# EAGLE design circuitdraft (EAGLE 9.5.2)
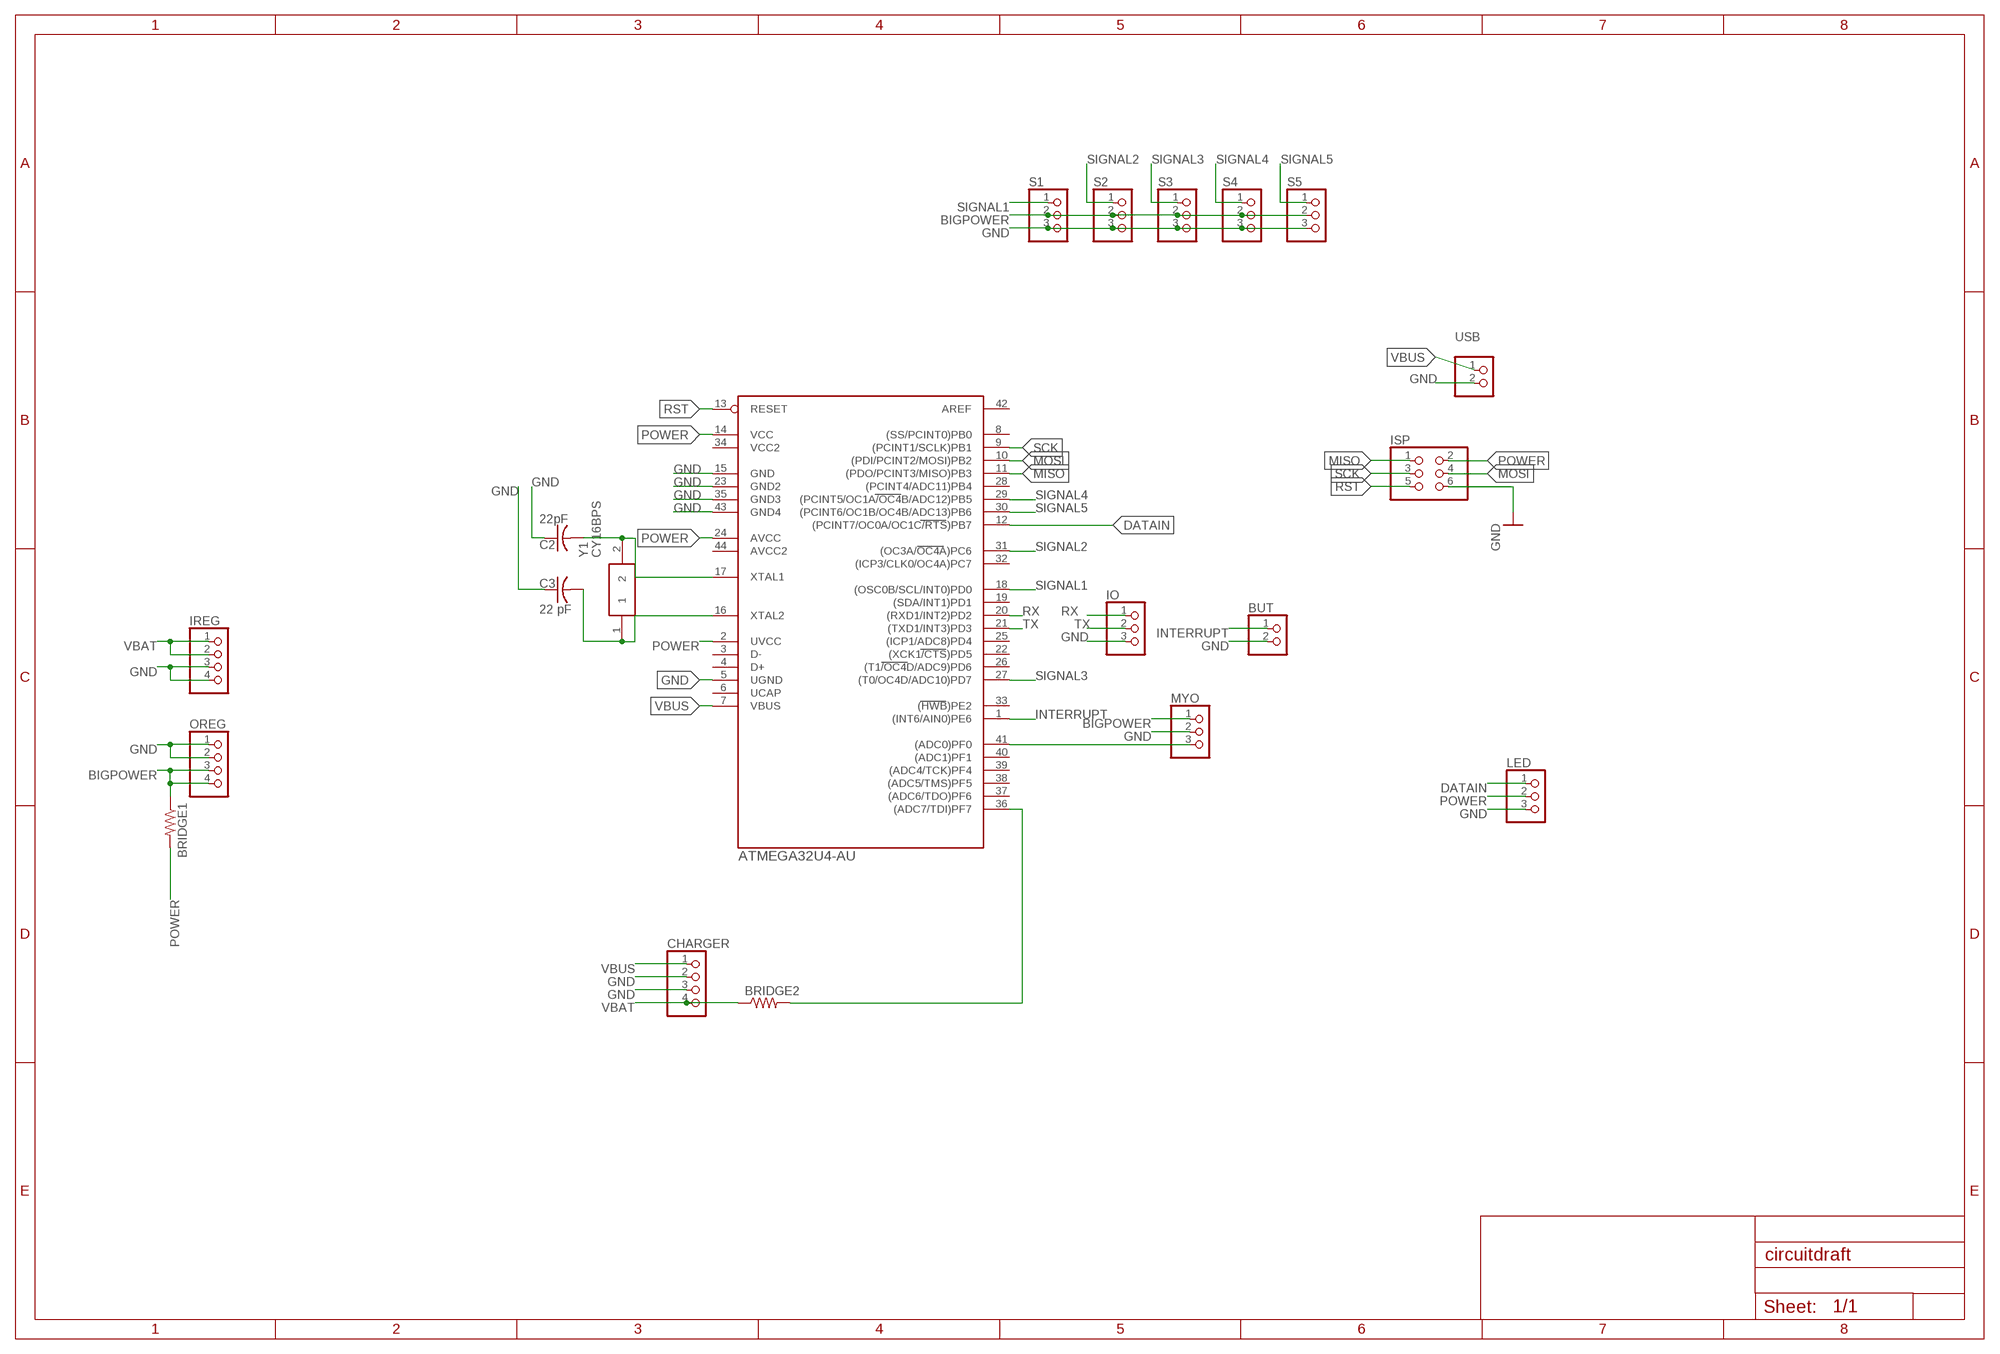
[diagram p0: schematic, sheet 1]

## Parts
BRIDGE1  R-US_M0805  [M0805]
BRIDGE2  R-US_M0805  [M0805]
BUT  PINHD-1X2  [1X02]
C2  22pF  C-US025-024X044  [C025-024X044]
C3  22 pF  C-US025-024X044  [C025-024X044]
CHARGER  PINHD-1X4  [1X04]
IO  PINHD-1X3  [1X03]
IREG  PINHD-1X4  [1X04]
ISP  PINHD-2X3  [2X03]
LED  PINHD-1X3  [1X03]
MYO  PINHD-1X3  [1X03]
OREG  PINHD-1X4  [1X04]
S1  PINHD-1X3  [1X03]
S2  PINHD-1X3  [1X03]
S3  PINHD-1X3  [1X03]
S4  PINHD-1X3  [1X03]
S5  PINHD-1X3  [1X03]
U$1  ATMEGA32U4-AU  [TQFP44]
USB  PINHD-1X2  [1X02]
Y1  CY16BPS  [CY16BPS]

## Nets
BIGPOWER [power]: BRIDGE1.1 MYO.1 OREG.3 OREG.4 S1.2 S2.2 S3.2 S4.2 S5.2
DATAIN: LED.1 U$1.12((PCINT7/OC0A/OC1C/RTS)PB7)
GND: BUT.2 C2.1 C3.1 CHARGER.2 CHARGER.3 IO.3 IREG.3 IREG.4 ISP.6 LED.3 MYO.2 OREG.1 OREG.2 S1.3 S2.3 S3.3 S4.3 S5.3 U$1.5(UGND) U$1.15(GND) U$1.23(GND2) U$1.35(GND3) U$1.43(GND4) USB.2
INTERRUPT: BUT.1 U$1.1((INT6/AIN0)PE6)
MISO: ISP.1 U$1.11((PDO/PCINT3/MISO)PB3)
MOSI: ISP.4 U$1.10((PDI/PCINT2/MOSI)PB2)
N$1: MYO.3 U$1.41((ADC0)PF0)
N$5: C2.2 U$1.17(XTAL1) Y1.2
N$6: C3.2 U$1.16(XTAL2) Y1.1
N$9: BRIDGE2.2 U$1.36((ADC7/TDI)PF7)
POWER: BRIDGE1.2 ISP.2 LED.2 U$1.2(UVCC) U$1.14(VCC) U$1.24(AVCC)
RST: ISP.5 U$1.13(RESET)
RX: IO.1 U$1.20((RXD1/INT2)PD2)
SCK: ISP.3 U$1.9((PCINT1/SCLK)PB1)
SIGNAL1: S1.1 U$1.18((OSC0B/SCL/INT0)PD0)
SIGNAL2: S2.1 U$1.31((OC3A/OC4A)PC6)
SIGNAL3: S3.1 U$1.27((T0/OC4D/ADC10)PD7)
SIGNAL4: S4.1 U$1.29((PCINT5/OC1A/OC4B/ADC12)PB5)
SIGNAL5: S5.1 U$1.30((PCINT6/OC1B/OC4B/ADC13)PB6)
TX: IO.2 U$1.21((TXD1/INT3)PD3)
VBAT [power]: BRIDGE2.1 CHARGER.4 IREG.1 IREG.2
VBUS: CHARGER.1 U$1.7(VBUS) USB.1
Unconnected: U$1.3(D-) U$1.4(D+) U$1.6(UCAP) U$1.8((SS/PCINT0)PB0) U$1.19((SDA/INT1)PD1) U$1.22((XCK1/CTS)PD5) U$1.25((ICP1/ADC8)PD4) U$1.26((T1/OC4D/ADC9)PD6) U$1.28((PCINT4/ADC11)PB4) U$1.32((ICP3/CLK0/OC4A)PC7) U$1.33((HWB)PE2) U$1.34(VCC2) U$1.37((ADC6/TDO)PF6) U$1.38((ADC5/TMS)PF5) U$1.39((ADC4/TCK)PF4) U$1.40((ADC1)PF1) U$1.42(AREF) U$1.44(AVCC2)

## Library data of the parts
BRIDGE1 BRIDGE2 = rcl:R-US_: RESISTOR, American symbol; SPICEPREFIX: R
BUT USB = pinhead:PINHD-1X2: PIN HEADER
C2 C3 = rcl:C-US: CAPACITOR, American symbol; SPICEPREFIX: C
CHARGER IREG OREG = pinhead:PINHD-1X4: PIN HEADER
IO LED MYO S1-S5 = pinhead:PINHD-1X3: PIN HEADER
ISP = pinhead:PINHD-2X3: PIN HEADER
U$1 = mega32U4:ATMEGA32U4-AU
Y1 = SamacSys_Parts:CY16BPS: Crystals 16MHz 20pF 0C +70C Source: Datasheet <https://componentsearchengine.com/Datasheets/1/CY16BPS.pdf>; DESCRIPTION: Crystals 16MHz 20pF 0C +70C; HEIGHT: 5mm; MANUFACTURER_NAME: Crystek; MANUFACTURER_PART_NUMBER: CY16BPS; MOUSER_PART_NUMBER: 549-CY16BPS; MOUSER_PRICE-STOCK: https://www.mouser.com/Search/Refine.aspx?Keyword=549-CY16BPS

## Net classes
1 power: width 1 mm

## Board
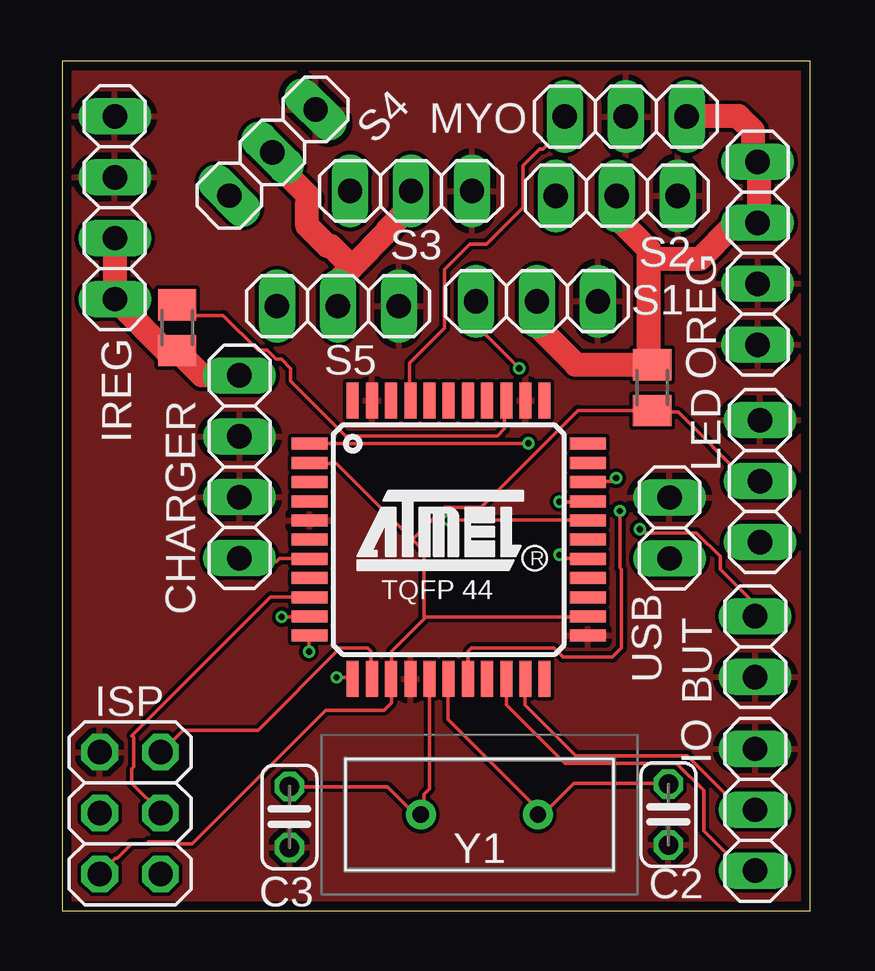
[diagram p1: board, top side]
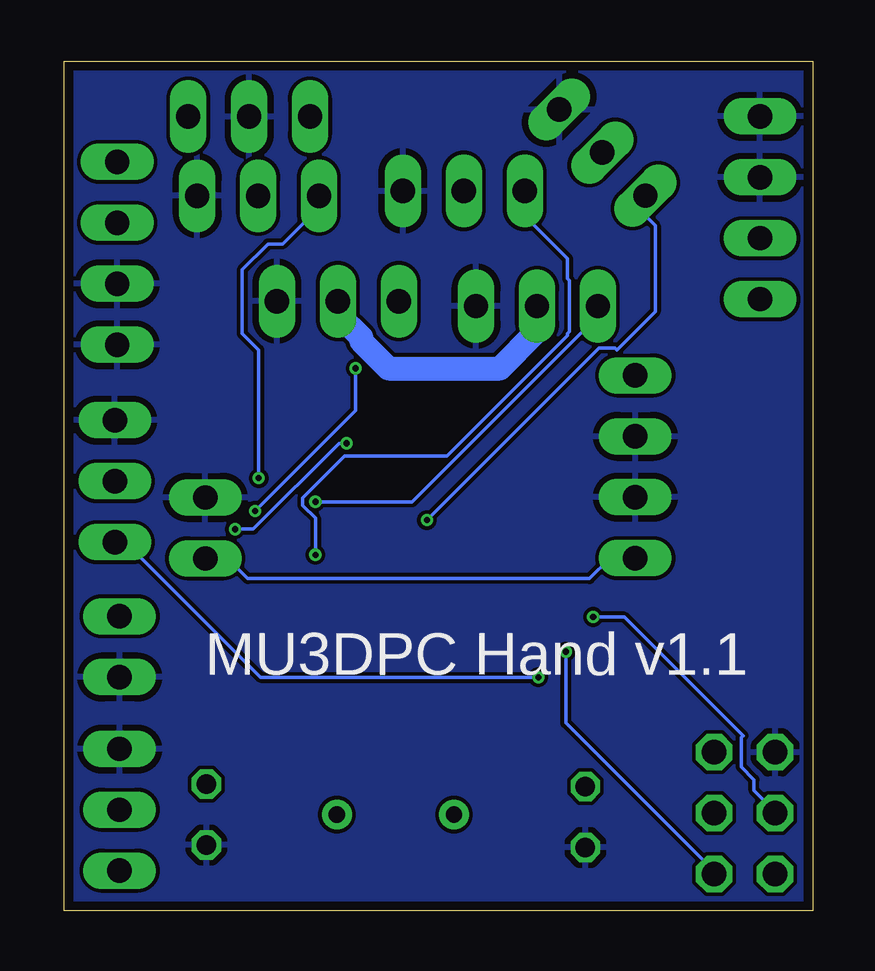
[diagram p2: board, bottom side, seen from below]

Size 31.2 x 35.4 mm. Coordinates in mm from the lower left corner, seen from the top.
Outline: 0,0 31.2,0 31.2,35.4 0,35.4 0,0
Copper layers (1*16): Top 0.035559375mm / dielectric 1.6mm / Bottom 0.035559375mm
Design rules "oshpark-2layer *": minimum track width 6mil, minimum drill 10mil, track to track 6mil, track to pad 6mil, pad to pad 6mil, via to via 6mil, smd to smd 6mil, copper to edge 15mil, drill to drill 6mil, minimum pad ring 5mil, minimum via ring 5mil, stop-mask expansion 2.5mil, vias tented up to drill 30mil, thermal gap 10mil

### Footprints (pad centres in the part's own frame; a part is rotated, then mirrored left to right if it is on the bottom)
M0805 = smd 1.3 x 1.6: 1 -0.95,0; 2 0.95,0
1X02 = drill 1.016 long: 1 -1.27,0; 2 1.27,0
C025-024X044 = drill 0.813 octagon: 1 -1.27,0; 2 1.27,0
1X04 = drill 1.016 long: 1 -3.81,0; 2 -1.27,0; 3 1.27,0; 4 3.81,0
1X03 = drill 1.016 long: 1 -2.54,0; 2 0,0; 3 2.54,0
2X03 = drill 1.016 octagon: 1 -2.54,-1.27; 2 -2.54,1.27; 3 0,-1.27; 4 0,1.27; 5 2.54,-1.27; 6 2.54,1.27
TQFP44 = smd 1.5 x 0.5: 1 -5.8,4; 2 -5.8,3.2; 3 -5.8,2.4; 4 -5.8,1.6; 5 -5.8,0.8; 6 -5.8,0; 7 -5.8,-0.8; 8 -5.8,-1.6; 9 -5.8,-2.4; 10 -5.8,-3.2; 11 -5.8,-4; 23 5.8,-4; 24 5.8,-3.2; 25 5.8,-2.4; 26 5.8,-1.6; 27 5.8,-0.8; 28 5.8,0; 29 5.8,0.8; 30 5.8,1.6; 31 5.8,2.4; 32 5.8,3.2; 33 5.8,4 | smd 0.5 x 1.5: 12 -4,-5.8; 13 -3.2,-5.8; 14 -2.4,-5.8; 15 -1.6,-5.8; 16 -0.8,-5.8; 17 0,-5.8; 18 0.8,-5.8; 19 1.6,-5.8; 20 2.4,-5.8; 21 3.2,-5.8; 22 4,-5.8; 34 4,5.8; 35 3.2,5.8; 36 2.4,5.8; 37 1.6,5.8; 38 0.8,5.8; 39 0,5.8; 40 -0.8,5.8; 41 -1.6,5.8; 42 -2.4,5.8; 43 -3.2,5.8; 44 -4,5.8
CY16BPS = drill 0.68 pad 1.247: 1 -2.44,0; 2 2.44,0

### Placement (x,y rotation side)
BRIDGE1  24.6,21.8 270 top
BRIDGE2  4.8,24.3 90 top
BUT  28.9,11 270 top
C2  25.28,4 90 top
C3  9.48,3.9 90 top
CHARGER  7.4,18.5 90 top
IO  28.9,4.2 90 top
IREG  2.2,29.3 90 top
ISP  2.84,4.06 90 top
LED  29.1,17.9 90 top
MYO  23.5,33.1 180 top
OREG  29,27.4 90 top
S1  19.8,25.4 0 top
S2  23.12,29.8 0 top
S3  14.55,30 0 top
S4  8.77,31.6 45 top
S5  11.5,25.2 0 top
U$1  16.12,15.46 0 top
USB  25.33,15.95 90 top
Y1  17.4,4 0 top

### Tracks (layer width: path | path; a pad name or v marks a point on that pad's centre or on a via)
BIGPOWER
  Top 1: 12.09,26.83 13.57,28.32 13.57,28.39 14.49,29.31 14.49,29.99 S3.2 | 12.09,26.83 11.52,26.26 11.52,25.27 S5.2 | 12.09,26.83 11.21,27.71 11.06,27.71 10.22,28.55 10.22,29.54 10.3,29.61 10.22,29.69 10.22,29.84 8.85,31.21 8.85,31.59 S4.2 | MYO.1 26.07,33.12 28.21,33.12 28.82,32.51 28.82,31.67 OREG.4 29.04,31.14 29.04,28.7 OREG.3 28.51,28.55 27.98,28.55 26.61,27.18 24.47,27.18 | S1.2 19.82,25.35 19.82,24.36 21.42,22.76 24.55,22.76 BRIDGE1.1 24.47,23.21 24.47,27.18 | 24.47,27.18 24.47,27.56 23.18,28.85 23.18,29.77 S2.2
  Bottom 1: S5.2 11.52,25.19 11.52,24.13 13.04,22.6 17.69,22.6 18.83,23.75 18.83,23.9 19.75,24.81 19.75,25.35 S1.2
DATAIN  (via drill 0.25)
  Top 0.152: v11.44,9.72 12.05,9.72 U$1.12
  Bottom 0.152: v11.44,9.72 23.02,9.72 28.59,15.29 29.04,15.29 LED.1
GND
  pour Top: -12.3,55.8 38.2,55.8 38.2,-7.1 -12.3,-7.1
  pour Bottom: -14.5,58.5 39.7,58.5 39.7,-8.2 -14.5,-8.2
INTERRUPT  (via drill 0.25)
  Top 0.152: v19.44,19.48 10.37,19.48 U$1.1 | v24.09,15.9 24.24,15.75 26.45,15.75 27.44,14.75 27.44,14.22 28.89,12.77 28.89,12.32 BUT.1
  Bottom 0.152: v19.44,19.48 19.75,19.48 23.33,15.9 v24.09,15.9
MISO  (via drill 0.25)
  Top 0.152: v10.3,10.79 10.3,11.4 U$1.11
  Bottom 0.152: v10.3,10.79 10.3,7.82 4.05,1.57 ISP.1
MOSI  (via drill 0.25)
  Top 0.152: v9.15,12.24 10.3,12.24 U$1.10
  Bottom 0.152: v9.15,12.24 7.86,12.24 2.91,7.29 2.98,7.21 2.98,5.99 2.45,5.46 2.45,5 1.54,4.09 ISP.4
N$1
  Top 0.152: U$1.41 14.49,21.31 14.49,22.83 15.94,24.28 15.94,26.72 17,27.79 17.69,27.79 19.21,29.31 19.21,31.06 19.9,31.75 20.05,31.75 20.89,32.59 20.89,33.04 MYO.3
N$5
  Top 0.152: U$1.17 16.09,9.65 16.09,7.97 19.82,4.24 19.82,4.01 Y1.2 19.82,4.32 20.36,4.32 21.35,5.31 25.23,5.31 C2.2
N$6
  Top 0.152: 15.02,4.24 15.02,4.01 Y1.1 15.02,4.24 | 15.02,4.24 15.02,4.54 15.1,4.62 15.1,4.85 15.33,5.08 15.33,9.65 U$1.16 | 15.02,4.24 14.49,4.24 13.57,5.15 9.54,5.15 C3.2
N$9
  Top 0.152: U$1.36 18.45,21.23 18.45,20.09 18.15,19.78 11.82,19.78 9.54,22.07 9.54,22.6 9.15,22.98 8.93,22.98 8.54,23.36 8.16,23.36 6.72,24.81 5.19,24.81 4.81,25.19 BRIDGE2.2
POWER
  Top 0.152: LED.2 29.04,17.95 28.51,17.95 25.69,20.77 24.62,20.77 BRIDGE1.2 24.55,20.85 21.5,20.85 17.46,16.81 15.94,16.81 14.6,15.48 | 15.14,12.2 15.18,12.24 21.88,12.24 U$1.24 | 15.14,12.2 13.73,10.79 13.73,9.72 U$1.14 13.73,9.65 13.73,8.66 13.42,8.35 10.98,8.35 5.42,2.79 4.73,2.79 4.66,2.87 3.59,2.87 3.52,2.79 2.91,2.79 2.3,2.18 2.22,2.18 1.61,1.57 ISP.2 | 14.6,15.48 15.1,14.98 15.1,12.24 15.14,12.2 | 14.6,15.48 11.44,18.64 10.37,18.64 U$1.2
RST
  Top 0.152: U$1.13 12.89,9.72 12.89,10.79 12.74,10.95 11.59,10.95 8.16,7.52 5.04,7.52 4.13,6.6 ISP.5
RX
  Top 0.152: U$1.20 18.53,9.65 18.53,8.58 20.97,6.14 25.61,6.14 26.76,5 26.76,3.33 28.36,1.72 28.89,1.72 IO.1
SCK
  Top 0.152: U$1.9 10.3,13.08 8.7,13.08 2.91,7.29 2.98,7.21 2.98,5.99 2.91,5.91 2.91,5.31 4.13,4.09 ISP.3
SIGNAL1  (via drill 0.25)
  Top 0.152: v23.25,16.66 23.25,14.3 23.33,14.22 23.33,10.95 22.95,10.56 20.89,10.56 20.51,10.95 17.08,10.95 16.93,10.79 16.93,9.72 U$1.18 | v19.06,22.6 17.31,24.36 17.31,25.35 S1.1
  Bottom 0.152: v23.25,16.66 19.06,20.85 v19.06,22.6
SIGNAL2  (via drill 0.25)
  Top 0.152: v23.1,18.03 22.95,17.88 21.96,17.88 U$1.31
  Bottom 0.152: v23.1,18.03 23.1,23.36 23.79,24.05 23.79,26.72 22.72,27.79 22.11,27.79 20.58,29.31 S2.1
SIGNAL3  (via drill 0.25)
  Top 0.152: v20.74,14.83 20.89,14.68 21.88,14.68 U$1.27
  Bottom 0.152: v20.74,14.83 20.74,16.36 21.27,16.89 21.27,17.19 19.52,18.95 15.25,18.95 10.22,23.98 10.22,24.05 10.15,24.13 10.15,26.26 10.22,26.34 10.22,27.18 11.97,28.93 11.97,29.99 S3.1
SIGNAL4  (via drill 0.25)
  Top 0.152: v16.09,16.28 21.88,16.28 U$1.29
  Bottom 0.152: v16.09,16.28 8.93,23.44 8.24,23.44 8.16,23.36 6.56,24.96 6.56,28.55 6.95,28.93 6.95,29.77 S4.1
SIGNAL5  (via drill 0.25)
  Top 0.152: v20.74,17.04 21.88,17.04 U$1.30
  Bottom 0.152: v20.74,17.04 16.7,17.04 9,24.74 9,25.19 S5.1
TX
  Top 0.152: U$1.21 19.29,9.65 19.29,8.58 21.42,6.45 26.07,6.45 28.28,4.24 28.89,4.24 IO.2
VBAT
  Top 1: IREG.2 IREG.1 3.35,24.34 3.35,24.33 4.33,23.35 BRIDGE2.1 5.84,22.31 CHARGER.4
VBUS
  Top 0.152: U$1.7 10.3,14.68 9.08,14.68 8.93,14.53 8.77,14.68 7.4,14.68 CHARGER.1
  Bottom 0.152: USB.1 25.31,14.68 24.39,14.68 23.56,13.84 9.31,13.84 8.47,14.68 7.4,14.68 CHARGER.1

### Text on the board
bPlace: MU3DPC Hand v1.1